# Altium schematic sheet Microcontroller.SchDoc
size A4; SheetNumber: 6; SheetTotal: 11
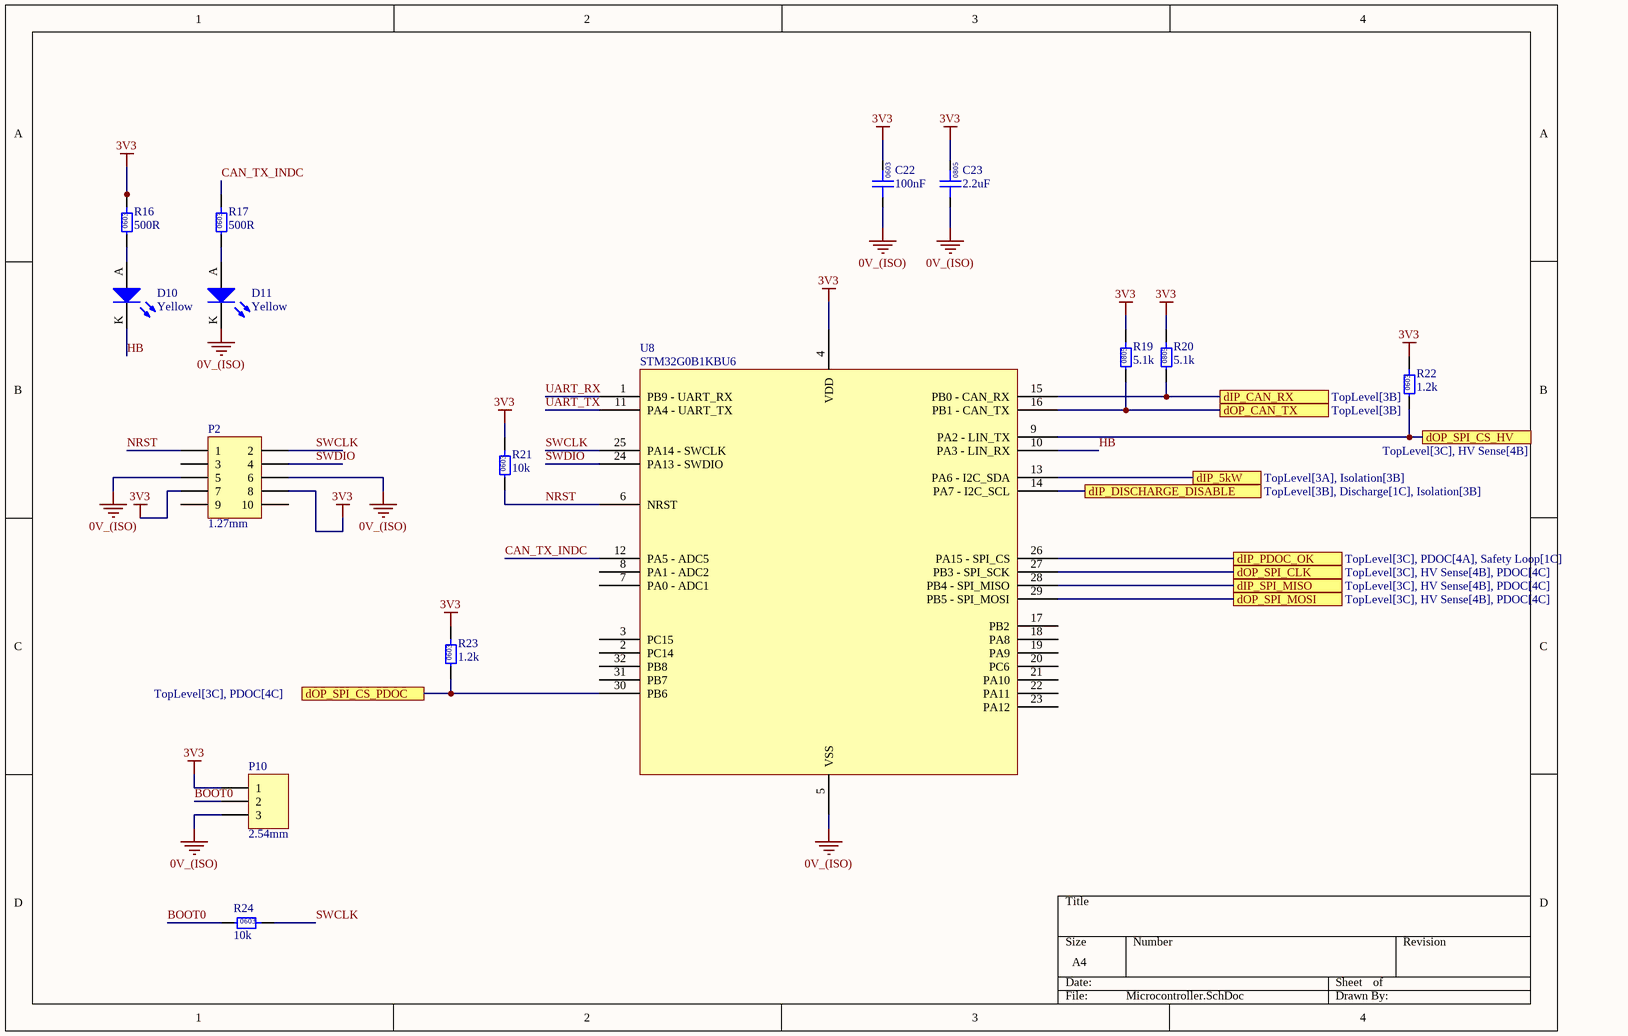
[diagram p0: Microcontroller.SchDoc]

## Parts
C22  100nF  [0603 Capacitor]
C23  2.2uF  [GCM21BR71H105KA03L-Footprint-1]
D10  Yellow  [0805 LED]
D11  Yellow  [0805 LED]
P2  1.27mm  [3221-10-0300-00]
P10  2.54mm  [TH 2.54mm Header 1x3]
R16  500R  [0603]
R17  500R  [0603]
R19  5.1k  [0805]
R20  5.1k  [0805]
R21  10k  [0603]
R22  1.2k  [0603]
R23  1.2k  [0603]
R24  10k  [0603]
U8  STM32G0B1KBU6  [ST-UFQFPN32]

## Ports
dIP_5kW (see TopLevel[3A], Isolation[3B]), dIP_CAN_RX (see TopLevel[3B]), dIP_DISCHARGE_DISABLE (see TopLevel[3B], Discharge[1C], Isolation[3B]), dIP_PDOC_OK (see TopLevel[3C], PDOC[4A], Safety Loop[1C]), dIP_SPI_MISO (see TopLevel[3C], HV Sense[4B], PDOC[4C]), dOP_CAN_TX (see TopLevel[3B]), dOP_SPI_CLK (see TopLevel[3C], HV Sense[4B], PDOC[4C]), dOP_SPI_CS_HV (see TopLevel[3C], HV Sense[4B]), dOP_SPI_CS_PDOC (see TopLevel[3C], PDOC[4C]), dOP_SPI_MOSI (see TopLevel[3C], HV Sense[4B], PDOC[4C])

## Nets
0V_(ISO): C22.1 C23.1 D11.K P2.5 P2.6 P10.3 U8.5(VSS)
3V3: C22.2 C23.2 P2.7 P2.8 P10.1 R16.2 R19.2 R20.2 R21.2 R22.2 R23.2 U8.4(VDD)
BOOT0: P10.2 R24.1
CAN_TX_INDC: R17.2 U8.12(PA5_-_ADC5)
dIP_5kW: U8.13(PA6_-_I2C_SDA) ; port dIP_5kW
dIP_CAN_RX: R20.1 U8.15(PB0_-_CAN_RX) ; port dIP_CAN_RX
dIP_DISCHARGE_DISABLE: U8.14(PA7_-_I2C_SCL) ; port dIP_DISCHARGE_DISABLE
dIP_PDOC_OK: U8.26(PA15_-_SPI_CS) ; port dIP_PDOC_OK
dIP_SPI_MISO: U8.28(PB4_-_SPI_MISO) ; port dIP_SPI_MISO
dOP_CAN_TX: R19.1 U8.16(PB1_-_CAN_TX) ; port dOP_CAN_TX
dOP_SPI_CLK: U8.27(PB3_-_SPI_SCK) ; port dOP_SPI_CLK
dOP_SPI_CS_HV: R22.1 U8.9(PA2_-_LIN_TX) ; port dOP_SPI_CS_HV
dOP_SPI_CS_PDOC: R23.1 U8.30(PB6) ; port dOP_SPI_CS_PDOC
dOP_SPI_MOSI: U8.29(PB5_-_SPI_MOSI) ; port dOP_SPI_MOSI
HB: D10.K U8.10(PA3_-_LIN_RX)
NRST: P2.1 R21.1 U8.6(NRST)
SWCLK: P2.2 R24.2 U8.25(PA14_-_SWCLK)
SWDIO: P2.4 U8.24(PA13_-_SWDIO)
UART_RX: U8.1(PB9_-_UART_RX)
UART_TX: U8.11(PA4_-_UART_TX)
NetD10_A: D10.A R16.1
NetD11_A: D11.A R17.1

Not connected (* = marked no-connect by the designer): P2 3 9 10; U8 2(PC14) 3(PC15) 7(PA0_-_ADC1) 8(PA1_-_ADC2) 17(PB2) 18(PA8) 19(PA9) 20(PC6) 21(PA10) 22(PA11) 23(PA12) 31(PB7) 32(PB8)

## Notes on the sheet
- (in symbol CMP-102-000031-7) 0603
- (in symbol CMP-102-000032-2) 0805
- (in symbol RC0603FR-0710KL) 0603
- (in symbol RC0603JR-071K2L) 0603
- (in symbol RC0805FR075K1L) 0805
- (in symbol RT0603BRD07500RL) 0603

## Library data of the parts
C22 = CMP-102-000031-7: Ceramic Capacitor, Multilayer, Ceramic, 50V, 10% +Tol, 10% -Tol, X8L, -40/+15% TC, 0.1uF, Surface Mount, 0603; Part Number: GCM188L81H104KA57D; Material: X8L; Digikey Link: https://www.digikey.com.au/en/products/detail/murata-electronics/GCM188L81H104KA57D/2591908?s=N4IgTCBcDaIOIGECyBGAHGgMmlAJFADACwDSAggKwDsAIiALoC%2BQA; Rated Voltage: 50V; Tolerance: 10%; Value: 100nF
C23 = CMP-102-000032-2: Ceramic Capacitor, Multilayer, Ceramic, 25V, 10% +Tol, 10% -Tol, X7R, 15% TC, 2.2uF, Surface Mount, 0805; Part Number: GRM21BR71E225KE11L; Rated Voltage: 50V; Value: 2.2µF; Material: X7R; Tolerance: 10%; Digikey Link: https://www.digikey.com.au/en/products/detail/murata-electronics/GRM21BR71E225KE11L/6606096?s=N4IgTCBcDaIOICUCyYCMAhBB2VBRMYArANK6qoAyIAugL5A
D10 D11 = SML-211YTT86: Yellow LED Indication - Discrete 1.75V 0805 (2012 Metric); Manufacturer: ROHM Semiconductor; Part Number: SML-211YTT86; Colour: Yellow; Digikey Part Number: 511-1293-1-ND
P2 = SMD 1.27mm Header 2x5 (3221-10-0300-00): Positions: 10; Angle: 0; Flange: No; Contact: NA; Part Number: SMD 1.27mm Header 2x5 (3221-10-0300-00); Pitch: 1.27mm; Row Spacing: 1.27mm
P10 = TH 2.54mm Header 1x3: Positions: 3; Angle: 0; Flange: No; Contact: NA; Part Number: TH 2.54mm Header 1x3; Pitch: 2.54mm; Row Spacing: 2.54mm
R16 R17 = RT0603BRD07500RL: Manufacturer: YAGEO; Tolerance: 0.01; Rated Power: 0.1W; Part Number: RT0603BRD07500RL; Value: 500R; Material: FR-07; Digikey Part Number: 13-RT0603BRD07500RL-ND
R19 R20 = RC0805FR075K1L: Manufacturer: YAGEO; Tolerance: 0.01; Rated Power: 0.125W; Part Number: RC0805FR075K1L; Value: 5.1k; Material: FR-07; Digikey Part Number: 311-5.10KCRCT-ND
R21 R24 = RC0603FR-0710KL: Manufacturer: YAGEO; Tolerance: 0.01; Rated Power: 0.1W; Part Number: RC0603FR-0710KL; Value: 10k; Digikey Part Number: 311-10.0KHRCT-ND; Material: FR-07
R22 R23 = RC0603JR-071K2L: Manufacturer: YAGEO; Tolerance: 0.01; Rated Power: 0.1W; Part Number: RC0603JR-071K2L; Value: 1.2k; Material: FR-07; Digikey Part Number: 311-1.2KGRCT-ND
U8 = CMP-029-000004-2: RISC Microcontroller, 32-Bit, FLASH, Cortex-M0+ CPU, 64MHz, CMOS